# EAGLE schematic untitled (EAGLE 6.6.0)

## Sheet 1 of 3
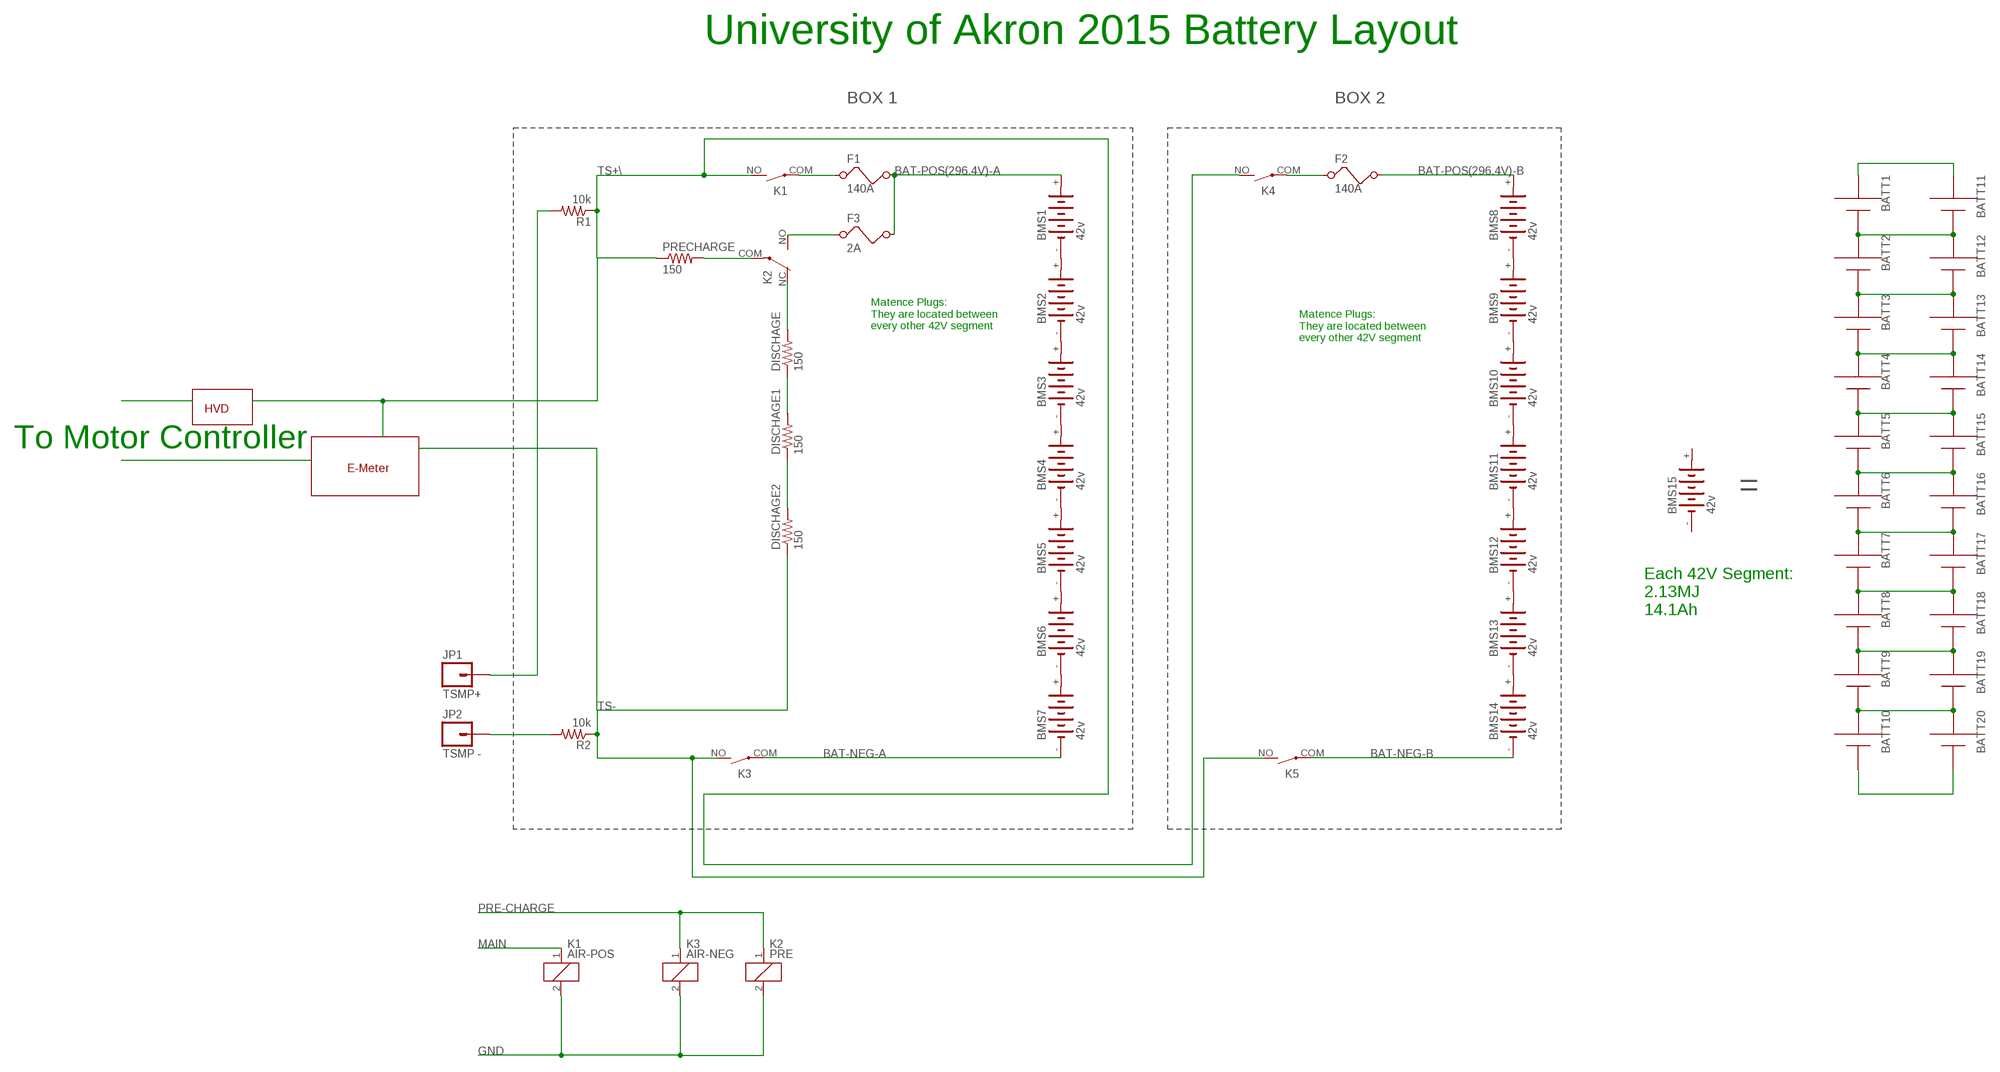
[diagram p0: schematic, sheet 1]

### Parts
BATT1  AAA  [12BH412]
BATT2  AAA  [12BH412]
BATT3  AAA  [12BH412]
BATT4  AAA  [12BH412]
BATT5  AAA  [12BH412]
BATT6  AAA  [12BH412]
BATT7  AAA  [12BH412]
BATT8  AAA  [12BH412]
BATT9  AAA  [12BH412]
BATT10  AAA  [12BH412]
BATT11  AAA  [12BH412]
BATT12  AAA  [12BH412]
BATT13  AAA  [12BH412]
BATT14  AAA  [12BH412]
BATT15  AAA  [12BH412]
BATT16  AAA  [12BH412]
BATT17  AAA  [12BH412]
BATT18  AAA  [12BH412]
BATT19  AAA  [12BH412]
BATT20  AAA  [12BH412]
BMS1  42v  VST4V8  [VST4]
BMS2  42v  VST4V8  [VST4]
BMS3  42v  VST4V8  [VST4]
BMS4  42v  VST4V8  [VST4]
BMS5  42v  VST4V8  [VST4]
BMS6  42v  VST4V8  [VST4]
BMS7  42v  VST4V8  [VST4]
BMS8  42v  VST4V8  [VST4]
BMS9  42v  VST4V8  [VST4]
BMS10  42v  VST4V8  [VST4]
BMS11  42v  VST4V8  [VST4]
BMS12  42v  VST4V8  [VST4]
BMS13  42v  VST4V8  [VST4]
BMS14  42v  VST4V8  [VST4]
BMS15  42v  VST4V8  [VST4]
DISCHAGE  150  2.0KOHM1/10W5%(0603)  [0603-RES]
DISCHAGE1  150  2.0KOHM1/10W5%(0603)  [0603-RES]
DISCHAGE2  150  2.0KOHM1/10W5%(0603)  [0603-RES]
F1  140A  FUSE  [FUSE]
F2  140A  FUSE  [FUSE]
F3  2A  FUSE  [FUSE]
JP1  TSMP+  M01-SMTSO-256-ET  [SMTSO-256-ET]
JP2  TSMP -  M01-SMTSO-256-ET  [SMTSO-256-ET]
K1  AIR-POS  APF30212A  [APF30212A]
K2  PRE  APF30212C  [APF30212C]
K3  AIR-NEG  APF30212A  [APF30212A]
K4  AIR-POS  APF30212A  [APF30212A]
K5  AIR-NEG  APF30212A  [APF30212A]
PRECHARGE  150  2.0KOHM1/10W5%(0603)  [0603-RES]
R1  10k  RESISTOR0805-RES  [0805]
R2  10k  RESISTOR0805-RES  [0805]

### Nets
BAT-NEG-A: BMS7.- K3.COM(2:P)
BAT-NEG-B: BMS14.- K5.COM(2:P)
BAT-POS(296.4V)-A: BMS1.+ F1.2 F3.2
BAT-POS(296.4V)-B: BMS8.+ F2.2
GND: K1.2 K2.2 K3.2
MAIN: K1.1
MP1: BMS1.- BMS2.+
N$2: BMS2.- BMS3.+
N$3: DISCHAGE1.2 DISCHAGE.1
N$4: BMS3.- BMS4.+
N$5: DISCHAGE1.1 DISCHAGE2.2
N$6: BMS4.- BMS5.+
N$7: JP1.P$1 R1.2
N$8: BMS5.- BMS6.+
N$9: K2.COM(2:P) PRECHARGE.2
N$10: BMS6.- BMS7.+
N$11: BMS8.- BMS9.+
N$12: BMS9.- BMS10.+
N$13: BMS10.- BMS11.+
N$14: BMS11.- BMS12.+
N$15: DISCHAGE.2 K2.NC(2:O)
N$16: JP2.P$1 R2.2
N$17: BMS12.- BMS13.+
N$18: BMS13.- BMS14.+
N$19: F1.1 K1.COM(2:P)
N$20: F3.1 K2.NO(2:S)
N$21: F2.1 K4.COM(2:P)
N$22: BATT1.+ BATT2.- BATT11.+ BATT12.-
N$23: BATT2.+ BATT3.- BATT12.+ BATT13.-
N$24: BATT3.+ BATT4.- BATT13.+ BATT14.-
N$25: BATT4.+ BATT5.- BATT14.+ BATT15.-
N$26: BATT6.+ BATT7.- BATT16.+ BATT17.-
N$27: BATT7.+ BATT8.- BATT17.+ BATT18.-
N$28: BATT8.+ BATT9.- BATT18.+ BATT19.-
N$29: BATT9.+ BATT10.- BATT19.+ BATT20.-
N$38: BATT1.- BATT11.-
N$39: BATT10.+ BATT20.+
N$40: BATT5.+ BATT6.- BATT15.+ BATT16.-
PRE-CHARGE: K2.1 K3.1
TS+\: K1.NO(2:S) K4.NO(2:S) PRECHARGE.1 R1.1
TS-: DISCHAGE2.1 K3.NO(2:S) K5.NO(2:S) R2.1
Unconnected: BMS1.+@1(+) BMS2.+@1(+) BMS3.+@1(+) BMS4.+@1(+) BMS5.+@1(+) BMS6.+@1(+) BMS7.+@1(+) BMS8.+@1(+) BMS9.+@1(+) BMS10.+@1(+) BMS11.+@1(+) BMS12.+@1(+) BMS13.+@1(+) BMS14.+@1(+) BMS15.+ BMS15.+@1(+) BMS15.- K4.1 K4.2 K5.1 K5.2

### Notes on the sheet
- University of Akron 2015 Battery Layout
- BOX 1 | BOX 2
- Matence Plugs:
  They are located between
  every other 42V segment
- Matence Plugs:
  They are located between
  every other 42V segment
- HVD
- To Motor Controller
- E-Meter
- =
- Each 42V Segment:
  2.13MJ
  14.1Ah

## Sheet 2 of 3
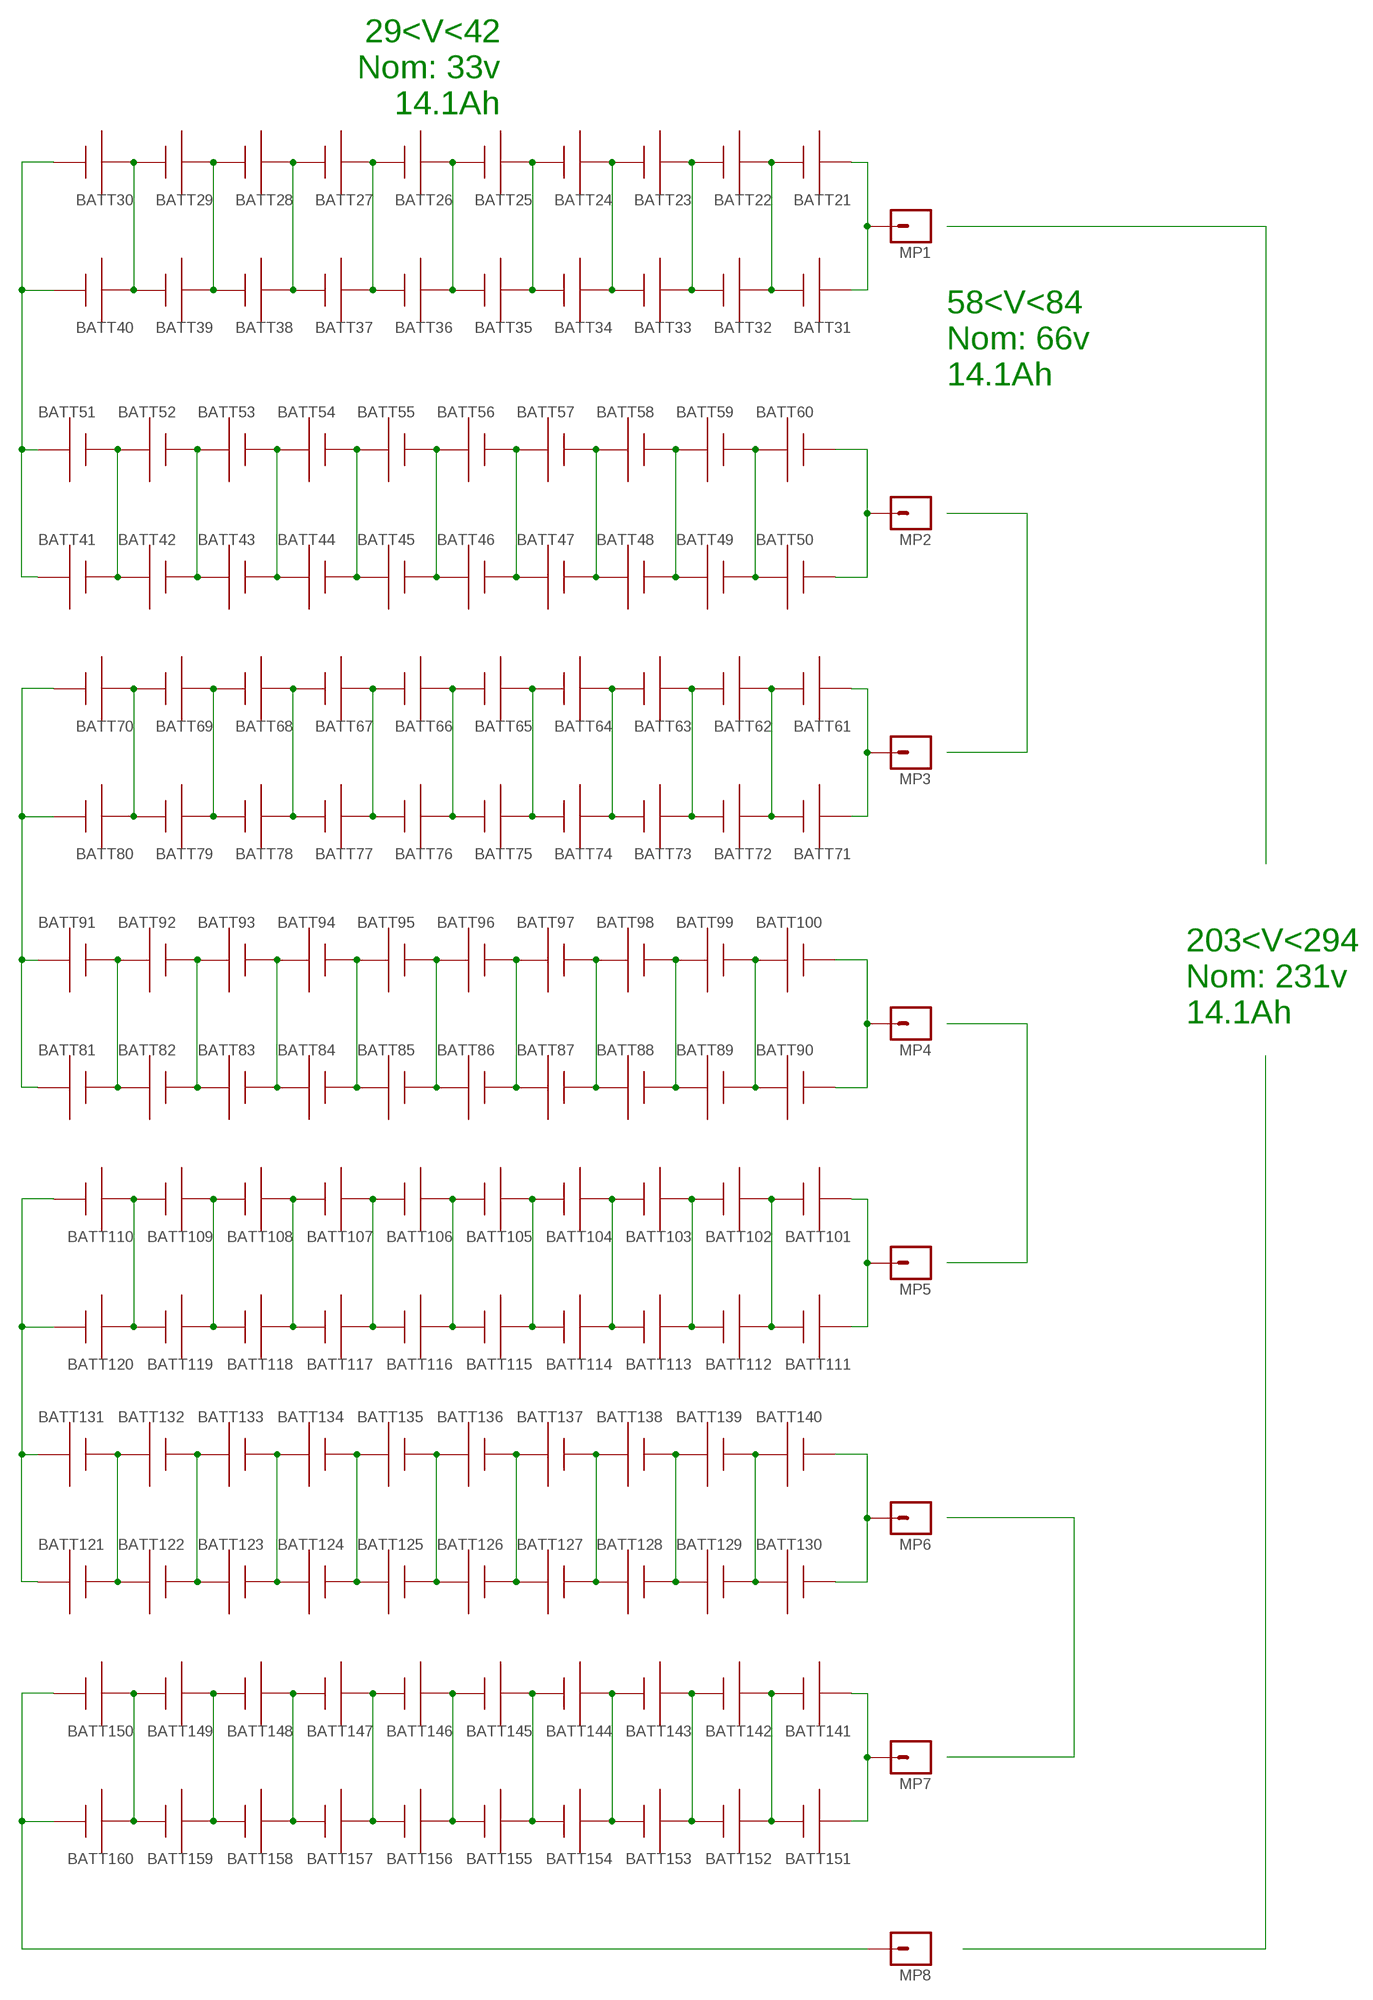
[diagram p1: schematic, sheet 2]

### Parts
BATT21  AAA  [12BH412]
BATT22  AAA  [12BH412]
BATT23  AAA  [12BH412]
BATT24  AAA  [12BH412]
BATT25  AAA  [12BH412]
BATT26  AAA  [12BH412]
BATT27  AAA  [12BH412]
BATT28  AAA  [12BH412]
BATT29  AAA  [12BH412]
BATT30  AAA  [12BH412]
BATT31  AAA  [12BH412]
BATT32  AAA  [12BH412]
BATT33  AAA  [12BH412]
BATT34  AAA  [12BH412]
BATT35  AAA  [12BH412]
BATT36  AAA  [12BH412]
BATT37  AAA  [12BH412]
BATT38  AAA  [12BH412]
BATT39  AAA  [12BH412]
BATT40  AAA  [12BH412]
BATT41  AAA  [12BH412]
BATT42  AAA  [12BH412]
BATT43  AAA  [12BH412]
BATT44  AAA  [12BH412]
BATT45  AAA  [12BH412]
BATT46  AAA  [12BH412]
BATT47  AAA  [12BH412]
BATT48  AAA  [12BH412]
BATT49  AAA  [12BH412]
BATT50  AAA  [12BH412]
BATT51  AAA  [12BH412]
BATT52  AAA  [12BH412]
BATT53  AAA  [12BH412]
BATT54  AAA  [12BH412]
BATT55  AAA  [12BH412]
BATT56  AAA  [12BH412]
BATT57  AAA  [12BH412]
BATT58  AAA  [12BH412]
BATT59  AAA  [12BH412]
BATT60  AAA  [12BH412]
BATT61  AAA  [12BH412]
BATT62  AAA  [12BH412]
BATT63  AAA  [12BH412]
BATT64  AAA  [12BH412]
BATT65  AAA  [12BH412]
BATT66  AAA  [12BH412]
BATT67  AAA  [12BH412]
BATT68  AAA  [12BH412]
BATT69  AAA  [12BH412]
BATT70  AAA  [12BH412]
BATT71  AAA  [12BH412]
BATT72  AAA  [12BH412]
BATT73  AAA  [12BH412]
BATT74  AAA  [12BH412]
BATT75  AAA  [12BH412]
BATT76  AAA  [12BH412]
BATT77  AAA  [12BH412]
BATT78  AAA  [12BH412]
BATT79  AAA  [12BH412]
BATT80  AAA  [12BH412]
BATT81  AAA  [12BH412]
BATT82  AAA  [12BH412]
BATT83  AAA  [12BH412]
BATT84  AAA  [12BH412]
BATT85  AAA  [12BH412]
BATT86  AAA  [12BH412]
BATT87  AAA  [12BH412]
BATT88  AAA  [12BH412]
BATT89  AAA  [12BH412]
BATT90  AAA  [12BH412]
BATT91  AAA  [12BH412]
BATT92  AAA  [12BH412]
BATT93  AAA  [12BH412]
BATT94  AAA  [12BH412]
BATT95  AAA  [12BH412]
BATT96  AAA  [12BH412]
BATT97  AAA  [12BH412]
BATT98  AAA  [12BH412]
BATT99  AAA  [12BH412]
BATT100  AAA  [12BH412]
BATT101  AAA  [12BH412]
BATT102  AAA  [12BH412]
BATT103  AAA  [12BH412]
BATT104  AAA  [12BH412]
BATT105  AAA  [12BH412]
BATT106  AAA  [12BH412]
BATT107  AAA  [12BH412]
BATT108  AAA  [12BH412]
BATT109  AAA  [12BH412]
BATT110  AAA  [12BH412]
BATT111  AAA  [12BH412]
BATT112  AAA  [12BH412]
BATT113  AAA  [12BH412]
BATT114  AAA  [12BH412]
BATT115  AAA  [12BH412]
BATT116  AAA  [12BH412]
BATT117  AAA  [12BH412]
BATT118  AAA  [12BH412]
BATT119  AAA  [12BH412]
BATT120  AAA  [12BH412]
BATT121  AAA  [12BH412]
BATT122  AAA  [12BH412]
BATT123  AAA  [12BH412]
BATT124  AAA  [12BH412]
BATT125  AAA  [12BH412]
BATT126  AAA  [12BH412]
BATT127  AAA  [12BH412]
BATT128  AAA  [12BH412]
BATT129  AAA  [12BH412]
BATT130  AAA  [12BH412]
BATT131  AAA  [12BH412]
BATT132  AAA  [12BH412]
BATT133  AAA  [12BH412]
BATT134  AAA  [12BH412]
BATT135  AAA  [12BH412]
BATT136  AAA  [12BH412]
BATT137  AAA  [12BH412]
BATT138  AAA  [12BH412]
BATT139  AAA  [12BH412]
BATT140  AAA  [12BH412]
BATT141  AAA  [12BH412]
BATT142  AAA  [12BH412]
BATT143  AAA  [12BH412]
BATT144  AAA  [12BH412]
BATT145  AAA  [12BH412]
BATT146  AAA  [12BH412]
BATT147  AAA  [12BH412]
BATT148  AAA  [12BH412]
BATT149  AAA  [12BH412]
BATT150  AAA  [12BH412]
BATT151  AAA  [12BH412]
BATT152  AAA  [12BH412]
BATT153  AAA  [12BH412]
BATT154  AAA  [12BH412]
BATT155  AAA  [12BH412]
BATT156  AAA  [12BH412]
BATT157  AAA  [12BH412]
BATT158  AAA  [12BH412]
BATT159  AAA  [12BH412]
BATT160  AAA  [12BH412]
MP1  M01POGOPIN_HOLE_0.58  [1X01_POGOPIN_HOLE_0.58]
MP2  M01POGOPIN_HOLE_0.58  [1X01_POGOPIN_HOLE_0.58]
MP3  M01POGOPIN_HOLE_0.58  [1X01_POGOPIN_HOLE_0.58]
MP4  M01POGOPIN_HOLE_0.58  [1X01_POGOPIN_HOLE_0.58]
MP5  M01POGOPIN_HOLE_0.58  [1X01_POGOPIN_HOLE_0.58]
MP6  M01POGOPIN_HOLE_0.58  [1X01_POGOPIN_HOLE_0.58]
MP7  M01POGOPIN_HOLE_0.58  [1X01_POGOPIN_HOLE_0.58]
MP8  M01POGOPIN_HOLE_0.58  [1X01_POGOPIN_HOLE_0.58]

### Nets
N$1: BATT21.+ BATT22.- BATT31.+ BATT32.-
N$30: BATT22.+ BATT23.- BATT32.+ BATT33.-
N$31: BATT23.+ BATT24.- BATT33.+ BATT34.-
N$32: BATT24.+ BATT25.- BATT34.+ BATT35.-
N$33: BATT26.+ BATT27.- BATT36.+ BATT37.-
N$34: BATT27.+ BATT28.- BATT37.+ BATT38.-
N$35: BATT28.+ BATT29.- BATT38.+ BATT39.-
N$36: BATT29.+ BATT30.- BATT39.+ BATT40.-
N$37: BATT21.- BATT31.- MP1.1
N$42: BATT25.+ BATT26.- BATT35.+ BATT36.-
N$43: BATT41.+ BATT42.- BATT51.+ BATT52.-
N$44: BATT42.+ BATT43.- BATT52.+ BATT53.-
N$45: BATT43.+ BATT44.- BATT53.+ BATT54.-
N$46: BATT44.+ BATT45.- BATT54.+ BATT55.-
N$47: BATT46.+ BATT47.- BATT56.+ BATT57.-
N$48: BATT47.+ BATT48.- BATT57.+ BATT58.-
N$49: BATT48.+ BATT49.- BATT58.+ BATT59.-
N$50: BATT49.+ BATT50.- BATT59.+ BATT60.-
N$51: BATT30.+ BATT40.+ BATT41.- BATT51.-
N$52: BATT50.+ BATT60.+ MP2.1
N$53: BATT45.+ BATT46.- BATT55.+ BATT56.-
N$55: BATT61.+ BATT62.- BATT71.+ BATT72.-
N$56: BATT62.+ BATT63.- BATT72.+ BATT73.-
N$57: BATT63.+ BATT64.- BATT73.+ BATT74.-
N$58: BATT64.+ BATT65.- BATT74.+ BATT75.-
N$59: BATT66.+ BATT67.- BATT76.+ BATT77.-
N$60: BATT67.+ BATT68.- BATT77.+ BATT78.-
N$61: BATT68.+ BATT69.- BATT78.+ BATT79.-
N$62: BATT69.+ BATT70.- BATT79.+ BATT80.-
N$63: BATT61.- BATT71.- MP3.1
N$64: BATT65.+ BATT66.- BATT75.+ BATT76.-
N$65: BATT81.+ BATT82.- BATT91.+ BATT92.-
N$66: BATT82.+ BATT83.- BATT92.+ BATT93.-
N$67: BATT83.+ BATT84.- BATT93.+ BATT94.-
N$68: BATT84.+ BATT85.- BATT94.+ BATT95.-
N$69: BATT86.+ BATT87.- BATT96.+ BATT97.-
N$70: BATT87.+ BATT88.- BATT97.+ BATT98.-
N$71: BATT88.+ BATT89.- BATT98.+ BATT99.-
N$72: BATT89.+ BATT90.- BATT99.+ BATT100.-
N$73: BATT70.+ BATT80.+ BATT81.- BATT91.-
N$74: BATT90.+ BATT100.+ MP4.1
N$75: BATT85.+ BATT86.- BATT95.+ BATT96.-
N$77: BATT101.+ BATT102.- BATT111.+ BATT112.-
N$78: BATT102.+ BATT103.- BATT112.+ BATT113.-
N$79: BATT103.+ BATT104.- BATT113.+ BATT114.-
N$80: BATT104.+ BATT105.- BATT114.+ BATT115.-
N$81: BATT106.+ BATT107.- BATT116.+ BATT117.-
N$82: BATT107.+ BATT108.- BATT117.+ BATT118.-
N$83: BATT108.+ BATT109.- BATT118.+ BATT119.-
N$84: BATT109.+ BATT110.- BATT119.+ BATT120.-
N$85: BATT101.- BATT111.- MP5.1
N$86: BATT105.+ BATT106.- BATT115.+ BATT116.-
N$87: BATT121.+ BATT122.- BATT131.+ BATT132.-
N$88: BATT122.+ BATT123.- BATT132.+ BATT133.-
N$89: BATT123.+ BATT124.- BATT133.+ BATT134.-
N$90: BATT124.+ BATT125.- BATT134.+ BATT135.-
N$91: BATT126.+ BATT127.- BATT136.+ BATT137.-
N$92: BATT127.+ BATT128.- BATT137.+ BATT138.-
N$93: BATT128.+ BATT129.- BATT138.+ BATT139.-
N$94: BATT129.+ BATT130.- BATT139.+ BATT140.-
N$95: BATT110.+ BATT120.+ BATT121.- BATT131.-
N$96: BATT130.+ BATT140.+ MP6.1
N$97: BATT125.+ BATT126.- BATT135.+ BATT136.-
N$99: BATT141.+ BATT142.- BATT151.+ BATT152.-
N$100: BATT142.+ BATT143.- BATT152.+ BATT153.-
N$101: BATT143.+ BATT144.- BATT153.+ BATT154.-
N$102: BATT144.+ BATT145.- BATT154.+ BATT155.-
N$103: BATT146.+ BATT147.- BATT156.+ BATT157.-
N$104: BATT147.+ BATT148.- BATT157.+ BATT158.-
N$105: BATT148.+ BATT149.- BATT158.+ BATT159.-
N$106: BATT149.+ BATT150.- BATT159.+ BATT160.-
N$107: BATT141.- BATT151.- MP7.1
N$108: BATT145.+ BATT146.- BATT155.+ BATT156.-
N$109: BATT150.+ BATT160.+ MP8.1

### Notes on the sheet
- 29<V<42
  Nom: 33v
  14.1Ah
- 58<V<84
  Nom: 66v
  14.1Ah
- 203<V<294
  Nom: 231v
  14.1Ah

## Sheet 3 of 3
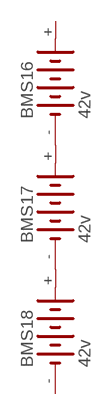
[diagram p2: schematic, sheet 3]

### Parts
BMS16  42v  VST4V8  [VST4]
BMS17  42v  VST4V8  [VST4]
BMS18  42v  VST4V8  [VST4]

### Nets
N$41: BMS16.- BMS17.+
N$54: BMS17.- BMS18.+
Unconnected: BMS16.+ BMS16.+@1(+) BMS17.+@1(+) BMS18.+@1(+) BMS18.-

## Library data of the parts
BATT1-BATT160 = adafruit:AAA: AAA PC pin holder Mouser part #12BH412 - but pretty much any 1x AAA battery holder should be the same http://www.ladyada.net/library/pcb/eaglelibrary.html
BMS1-BMS18 = battery:VST4V8: NC ACCU Varta Safe Tronic 4V8
DISCHAGE DISCHAGE1 DISCHAGE2 PRECHARGE = SparkFun-Resistors:2.0KOHM1/10W5%(0603): RES-08296; PROD_ID: RES-08296; VALUE: 2.0k
F1-F3 = special:FUSE: FUSE 5 x 20 mm
JP1 JP2 MP1-MP8 = SparkFun-Connectors:M01: Header 1 Standard 1-pin 0.1" header. Use with straight break away headers (SKU : PRT-00116), right angle break away headers (PRT-00553), swiss pins (PRT-00743), machine pins (PRT-00117), and female headers (PRT-00115).
K1 K3-K5 = relay:APF30212A: Compliant with European standards 1a/1c 6A Slim power relays Source: Data sheet <http://pewa.panasonic.com/assets/pcsd/catalog/pf-catalog.pdf>; OC_FARNELL: unknown
K2 = relay:APF30212C: Compliant with European standards 1a/1c 6A Slim power relays Source: Data sheet <http://pewa.panasonic.com/assets/pcsd/catalog/pf-catalog.pdf>; OC_FARNELL: unknown
R1 R2 = SparkFun-Passives:RESISTOR: Resistor Basic schematic elements and footprints for 0603, 1206, and PTH resistors.